# Altium schematic sheet Altimeter.SchDoc
size A; SheetNumber: 4; SheetTotal: 4
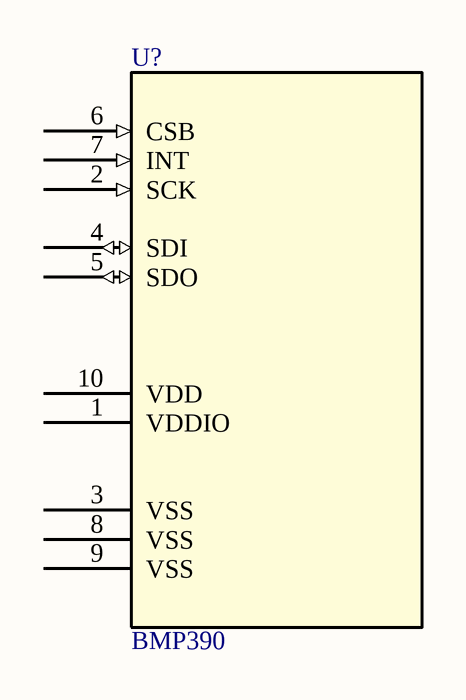
[diagram p0: Altimeter.SchDoc]

## Parts
U?  BMP390  [10LGA_2X2X0p75_BOS]

## Nets

Not connected (* = marked no-connect by the designer): U? 1(VDDIO) 2(SCK) 3(VSS) 4(SDI) 5(SDO) 6(CSB) 7(INT) 8(VSS) 9(VSS) 10(VDD)

## Library data of the parts
U? = BMP390: Description; Manufacturer_Name: Bosch Sensortec; Copyright: Copyright (C) 2025 Ultra Librarian. All rights reserved.; Manufacturer_Part_Number: BMP390; RefDes: RefDes; Type: Type